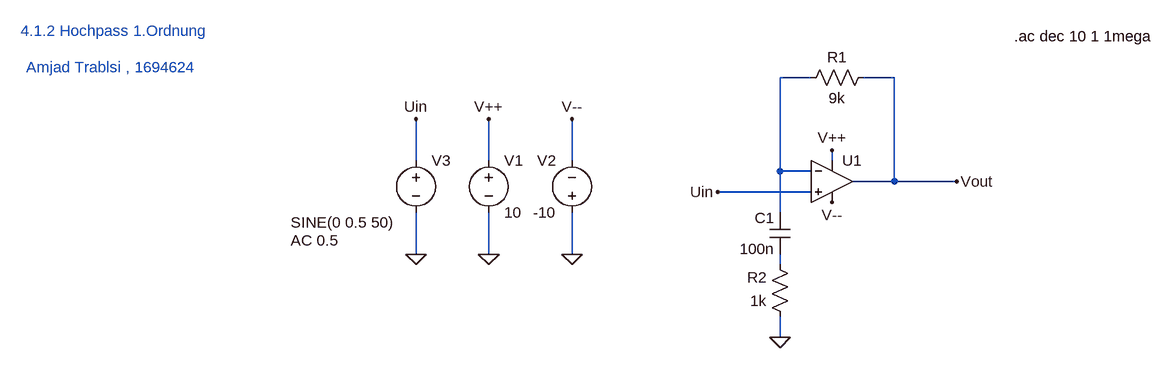
[diagram p0: schematic 4_1_2 hochpass_1_Ordnung.asc]
4_1_2 hochpass_1_Ordnung.asc, the LTspice schematic file:
Version 4
SHEET 1 956 680
WIRE 400 0 352 0
WIRE 528 0 480 0
WIRE -208 128 -208 64
WIRE -96 128 -96 64
WIRE 32 128 32 64
WIRE 432 128 432 112
WIRE 352 144 352 0
WIRE 400 144 352 144
WIRE 528 160 528 0
WIRE 528 160 464 160
WIRE 624 160 528 160
WIRE 400 176 256 176
WIRE 352 208 352 144
WIRE -208 272 -208 208
WIRE -96 272 -96 208
WIRE 32 272 32 208
WIRE 352 288 352 272
WIRE 352 400 352 368
FLAG 352 400 0
FLAG -96 272 0
FLAG -96 64 V++
FLAG 432 112 V++
FLAG 32 272 0
FLAG 32 64 V--
FLAG 432 192 V--
FLAG 624 160 Vout
FLAG -208 272 0
FLAG -208 64 Uin
FLAG 256 176 Uin
SYMBOL cap 368 272 R180
WINDOW 0 24 56 Left 2
WINDOW 3 24 8 Left 2
SYMATTR InstName C1
SYMATTR Value 100n
SYMBOL res 496 -16 R90
WINDOW 0 0 56 VBottom 2
WINDOW 3 32 56 VTop 2
SYMATTR InstName R1
SYMATTR Value 9k
SYMBOL res 368 384 R180
WINDOW 0 36 76 Left 2
WINDOW 3 36 40 Left 2
SYMATTR InstName R2
SYMATTR Value 1k
SYMBOL voltage -96 112 R0
WINDOW 123 0 0 Left 0
WINDOW 39 0 0 Left 0
SYMATTR InstName V1
SYMATTR Value 10
SYMBOL voltage 32 224 R180
WINDOW 0 24 96 Left 2
WINDOW 3 24 16 Left 2
WINDOW 123 0 0 Left 0
WINDOW 39 0 0 Left 0
SYMATTR InstName V2
SYMATTR Value -10
SYMBOL voltage -208 112 R0
WINDOW 3 -193 111 Left 2
WINDOW 123 -193 139 Left 2
WINDOW 39 0 0 Left 0
SYMATTR Value SINE(0 0.5 50)
SYMATTR Value2 AC 0.5
SYMATTR InstName V3
SYMBOL OpAmps/UniversalOpAmp 432 160 R0
SYMATTR InstName U1
TEXT -816 -72 Left 2 ;4.1.2 Hochpass 1.Ordnung
TEXT 712 -64 Left 2 !.ac dec 10 1 1mega
TEXT -808 -16 Left 2 ;Amjad Trablsi , 1694624

The netlist it stands for:
* 4_1_2 hochpass_1_Ordnung.asc
C1 N002 N001 100n
R1 Vout N001 9k
R2 0 N002 1k
V1 V++ 0 10
V2 0 V-- -10
V3 Uin 0 SINE(0 0.5 50) AC 0.5
XU1 Uin N001 V++ V-- Vout level1 Avol=1Meg GBW=10Meg Vos=0 En=0 Enk=0 In=0 Ink=0 Rin=500Meg  ; pins In+ In- V+ V- OUT
* 4.1.2 Hochpass 1.Ordnung
.ac dec 10 1 1mega
* Amjad Trablsi , 1694624
.lib UniversalOpAmp1.lib
.backanno
.end